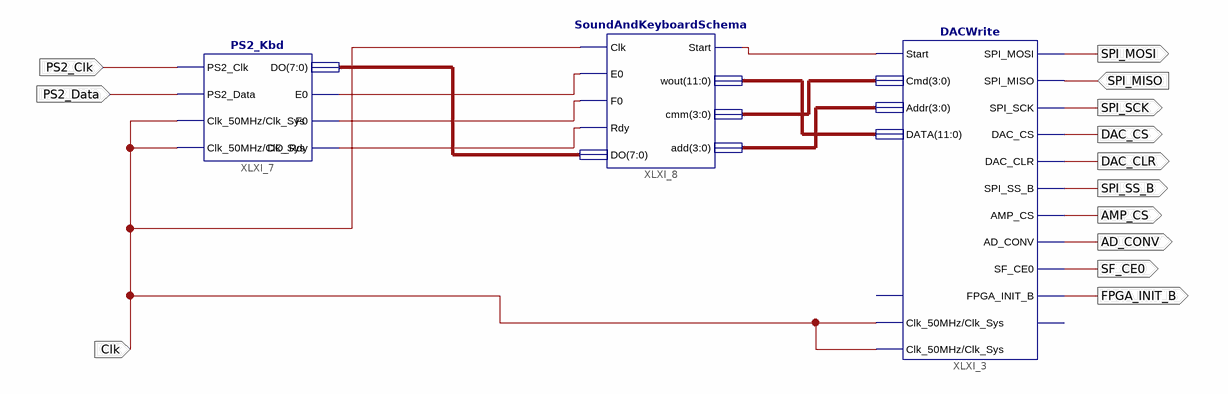
[diagram p0: schematic sheet 1]
// Xilinx ISE schematic allModulesSchema.sch (spartan3e) as structural Verilog: 3 symbols, 13 ports
module allModulesSchema (
  input  PS2_Clk,
  input  PS2_Data,
  input  SPI_MISO,
  input  Clk,
  output SPI_MOSI,
  output SPI_SCK,
  output DAC_CS,
  output DAC_CLR,
  output SPI_SS_B,
  output AMP_CS,
  output AD_CONV,
  output SF_CE0,
  output FPGA_INIT_B
);

  wire XLXN_21, XLXN_22, XLXN_25, XLXN_28;
  wire [3:0] XLXN_3, XLXN_4;
  wire [7:0] XLXN_24;
  wire [11:0] XLXN_2;

  DACWrite XLXI_3 (
    .Start(XLXN_28), .SPI_MISO(SPI_MISO), .Cmd(XLXN_4), .Addr(XLXN_3), .DATA(XLXN_2), .DAC_CLR(DAC_CLR),
    .DAC_CS(DAC_CS), .SPI_MOSI(SPI_MOSI), .SPI_SCK(SPI_SCK), .SPI_SS_B(SPI_SS_B), .AMP_CS(AMP_CS),
    .AD_CONV(AD_CONV), .SF_CE0(SF_CE0), .FPGA_INIT_B(FPGA_INIT_B), .Clk_50MHz(Clk), .Clk_Sys(Clk));  // open: Reset, Busy
  PS2_Kbd XLXI_7 (
    .PS2_Clk(PS2_Clk), .PS2_Data(PS2_Data), .Clk_50MHz(Clk), .E0(XLXN_21), .F0(XLXN_22), .DO_Rdy(XLXN_25),
    .DO(XLXN_24), .Clk_Sys(Clk));
  SoundAndKeyboardSchema XLXI_8 (
    .Clk(Clk), .E0(XLXN_21), .F0(XLXN_22), .Rdy(XLXN_25), .DO(XLXN_24), .Start(XLXN_28), .wout(XLXN_2),
    .cmm(XLXN_4), .add(XLXN_3));
endmodule
